# EasyEDA Pro project ProPrj_CH374_AG32.epro

# Schematic CH374
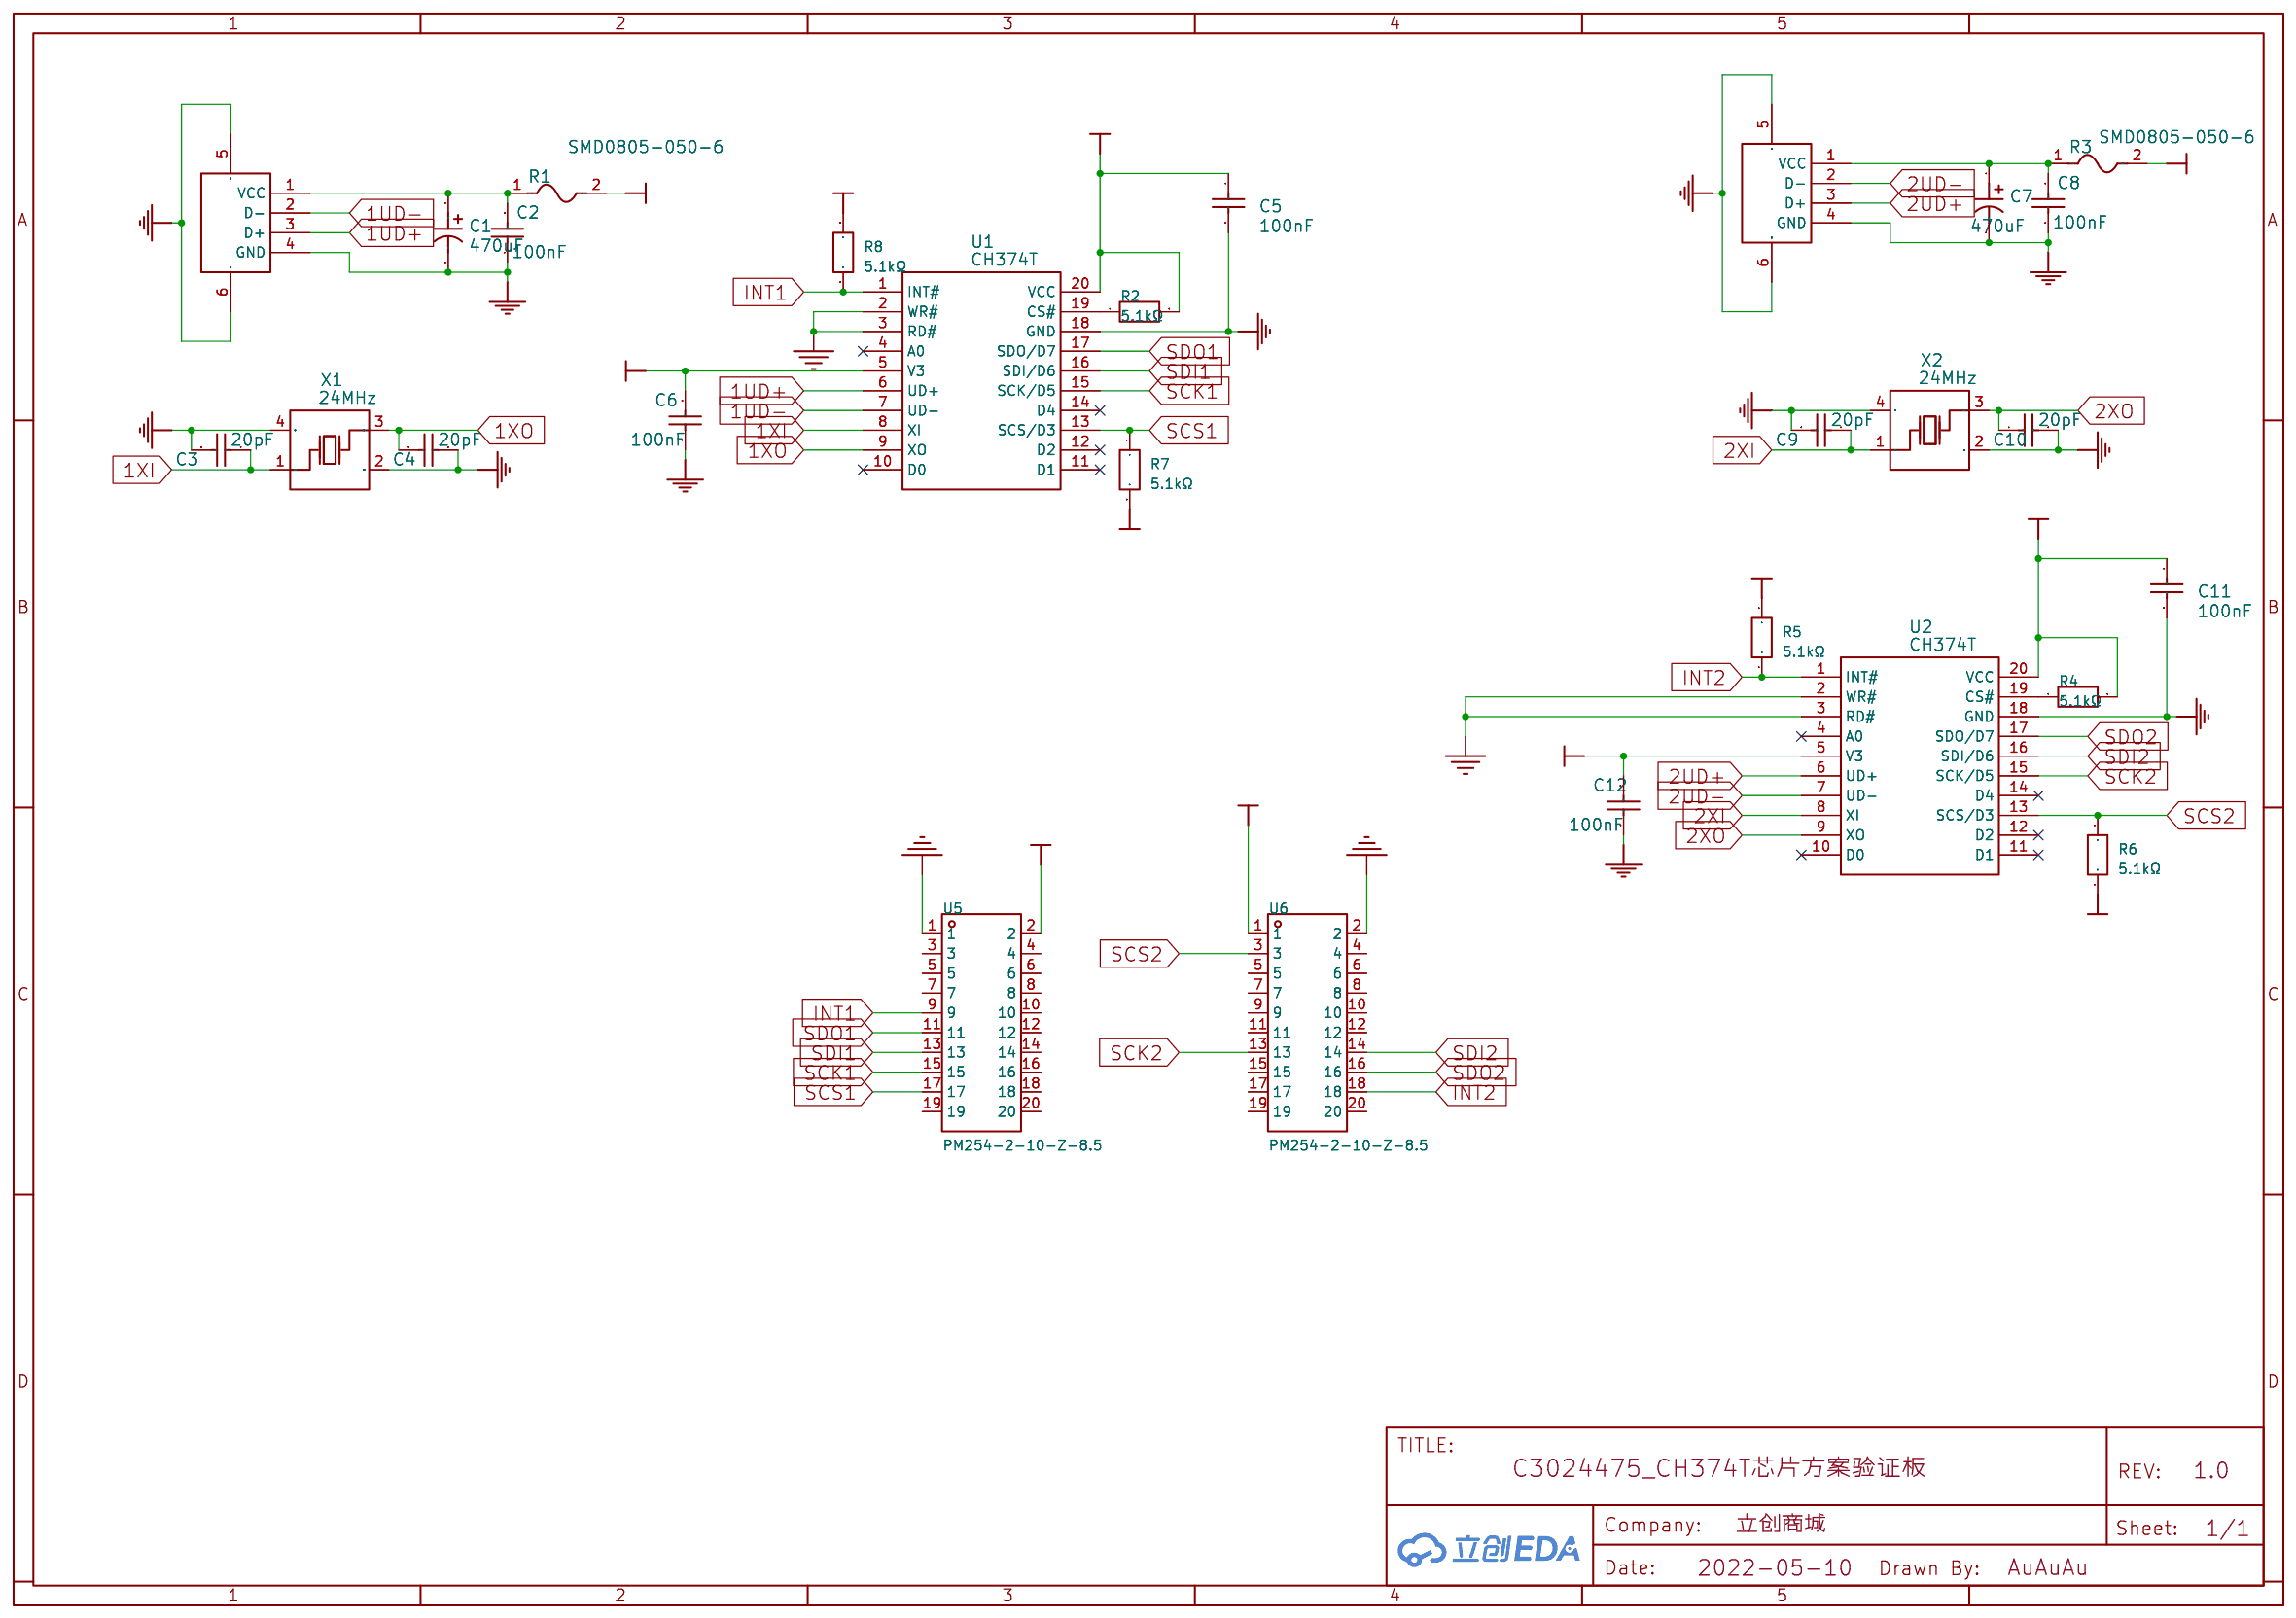
[diagram p0: schematic sheet]

## Parts
C1  470uF  [CAP-SMD_BD6.3-L6.6-W6.6-FD]
C2  100nF  [C0603]
C3  20pF  [C0603]
C4  20pF  [C0603]
C5  100nF  [C0603]
C6  100nF  [C0603]
C7  470uF  [CAP-SMD_BD6.3-L6.6-W6.6-FD]
C8  100nF  [C0603]
C9  20pF  [C0603]
C10  20pF  [C0603]
C11  100nF  [C0603]
C12  100nF  [C0603]
R1  SMD0805-050-6  [F0805]
R2  5.1kΩ  [R0603]
R3  SMD0805-050-6  [F0805]
R4  5.1kΩ  [R0603]
R5  5.1kΩ  [R0603]
R6  5.1kΩ  [R0603]
R7  5.1kΩ  [R0603]
R8  5.1kΩ  [R0603]
U1  CH374T  [SSOP-20_L7.5-W5.2-P0.65-LS8.0-BL]
U2  CH374T  [SSOP-20_L7.5-W5.2-P0.65-LS8.0-BL]
U5  PM254-2-10-Z-8.5  [HDR-TH_20P-P2.54-V-F-R2-C10-S2.54]
U6  PM254-2-10-Z-8.5  [HDR-TH_20P-P2.54-V-F-R2-C10-S2.54]
USB1  U-USBAR04P-F002  [USB-A-TH_USB-302-T]
USB2  U-USBAR04P-F002  [USB-A-TH_USB-302-T]
X1  24MHz  [CRYSTAL-SMD_4P-L3.2-W2.5-BL]
X2  24MHz  [CRYSTAL-SMD_4P-L3.2-W2.5-BL]

## Library data of the parts
C1 C7 = RVT1A471M0607_C335982: 容值:470uF;精度:±20%;额定电压:10V;纹波电流:200mA@120Hz;等效串联电阻(ESR):-;; LCSC Part Name: 470uF ±20% 10V; Supplier Part: C335982; Manufacturer: ROQANG(容强); Manufacturer Part: RVT1A471M0607; Supplier Footprint: SMD,D6.3xL7.7mm; JLCPCB Part Class: Extended Part; Supplier: LCSC; Tolerance: ±20%; Voltage Rating: 10V; Ripple Current: 200mA@120Hz; Diameter: 6.3mm; Height - Seated (Max): 7.7mm; Lifetime: 2000hrs@105℃; Operating Temperature: -40℃~+105℃; PCB Layer: TopLayer
C2 C5 C6 = 0603B104K500NT: 容值:100nF;精度:±10%;额定电压:50V;温度系数:X7R;; LCSC Part Name: 100nF ±10% 50V; Supplier Part: C30926; Manufacturer: FH(风华); Supplier Footprint: 0603; JLCPCB Part Class: Extended Part; Datasheet: https://item.szlcsc.com/datasheet/0603B104K500NT/31683.html; Supplier: LCSC; Tolerance: ±10%; Voltage Rating: 50V; Temperature Coefficient: X7R; PCB Layer: TopLayer
C3 C4 = CC0603JRNPO9BN200: 容值:20pF;精度:±5%;额定电压:50V;材质(温度系数):NP0;; LCSC Part Name: 20pF ±5% 50V; Supplier Part: C105621; Manufacturer: YAGEO(国巨); Supplier Footprint: 0603; JLCPCB Part Class: Extended Part; Datasheet: https://atta.szlcsc.com/upload/public/pdf/source/20170505/1493957838062.pdf; Supplier: LCSC; Tolerance: ±5%; Voltage Rated: 50V; Temperature Coefficient: NP0; PCB Layer: TopLayer
C8 C11 C12 = 0603B104K500NT: 容值:100nF;精度:±10%;额定电压:50V;温度系数:X7R;; LCSC Part Name: 100nF ±10% 50V; Supplier Part: C30926; Manufacturer: FH(风华); Supplier Footprint: 0603; JLCPCB Part Class: Extended Part; Datasheet: https://item.szlcsc.com/datasheet/0603B104K500NT/31683.html; Supplier: LCSC; Tolerance: ±10%; Voltage Rating: 50V; Temperature Coefficient: X7R; Origin 3D Model Title: C0603_L1.6-W0.8-H0.8; PCB Layer: TopLayer
C9 C10 = CC0603JRNPO9BN200: 容值:20pF;精度:±5%;额定电压:50V;材质(温度系数):NP0;; LCSC Part Name: 20pF ±5% 50V; Supplier Part: C105621; Manufacturer: YAGEO(国巨); Supplier Footprint: 0603; JLCPCB Part Class: Extended Part; Datasheet: https://atta.szlcsc.com/upload/public/pdf/source/20170505/1493957838062.pdf; Supplier: LCSC; Tolerance: ±5%; Voltage Rated: 50V; Temperature Coefficient: NP0; Origin 3D Model Title: C0603_L1.6-W0.8-H0.8; PCB Layer: TopLayer
R1 R3 = SMD0805-050-6: 耐压(Vmax):6V;最大电流(Imax):40A;保持电流(Ihold):500mA;跳闸电流(Itrip):1A;; LCSC Part Name: 6V 500mA; Supplier Part: C46640983; Manufacturer: R+O(宏嘉诚); Supplier Footprint: 0805; JLCPCB Part Class: Extended Part; Datasheet: https://item.szlcsc.com/datasheet/SMD0805-050-6/48798689.html; Supplier: LCSC; Voltage - Max: 6V; Current - Max: 40A; Hold Current: 500mA; Trip Current: 1A; Power Dissipation: 500mW; Resistance - Initial (Ri) (Min): 100mΩ; Resistance - Post Trip (R1) (Max): 850mΩ; Time to Trip(Max): 100ms; Operating Temperature: -40℃~+85℃; Length: 2.2mm; Width: 1.5mm; Height: 0.8mm
R2 R4-R8 = FRC0603F5101TS: 电阻类型:厚膜电阻;阻值:5.1kΩ;精度:±1%;功率:100mW;工作电压:75V;温度系数:±100ppm/℃;; LCSC Part Name: 5.1kΩ ±1% 100mW 厚膜电阻; Supplier Part: C2907044; Manufacturer: FOJAN(富捷); Supplier Footprint: 0603; JLCPCB Part Class: Extended Part; Supplier: LCSC; Type: 厚膜电阻; Tolerance: ±1%; Power(Watts): 100mW; Voltage-Supply(Max): 75V; Temperature Coefficient: ±100ppm/℃; Operating Temperature: -55℃~+155℃
U1 = CH374T: 应用功能:收发器;接口协议:USB 2.0;通道数:3;数据速率:12Mbps;; LCSC Part Name: USB总线接口芯片CH374; Supplier Part: C81627; Manufacturer: WCH(南京沁恒); Supplier Footprint: SSOP-20-208mil; JLCPCB Part Class: Extended Part; Datasheet: https://atta.szlcsc.com/upload/public/pdf/source/20240313/68BEEFB9FCA26BF3F560373D7752B1DD.pdf; Supplier: LCSC; Applications Function: 收发器; Protocol: USB 2.0; Number of Channels: 3; Supply Voltage: 5V；3.3V; Data Rate: 12Mbps; Operating Temperature: -40℃~+85℃; PCB Layer: TopLayer
U2 = CH374T: 应用功能:收发器;接口协议:USB 2.0;通道数:3;数据速率:12Mbps;; LCSC Part Name: USB总线接口芯片CH374; Supplier Part: C81627; Manufacturer: WCH(南京沁恒); Supplier Footprint: SSOP-20-208mil; JLCPCB Part Class: Extended Part; Datasheet: https://atta.szlcsc.com/upload/public/pdf/source/20240313/68BEEFB9FCA26BF3F560373D7752B1DD.pdf; Supplier: LCSC; Applications Function: 收发器; Protocol: USB 2.0; Number of Channels: 3; Supply Voltage: 5V；3.3V; Data Rate: 12Mbps; Operating Temperature: -40℃~+85℃; Origin 3D Model Title: SSOP-20_L7.3-W5.3-H2.0-LS8.0-P0.65; PCB Layer: TopLayer
U5 U6 = PM254-2-10-Z-8.5: 插孔结构:2x10P;间距:2.54mm;行距:2.54mm;圆孔/方孔:方孔;安装方式:直插;排数:双排;总孔位数:20P;额定电流:3A;额定电压:-;插孔方向:顶部;塑高:8.5mm;触头材质:铜合金;工作温度:-40℃~+105℃;; LCSC Part Name: 2x10P 间距:2.54mm 直插; Supplier Part: C2897411; Manufacturer: HCTL(华灿天禄); Supplier Footprint: 插件,P=2.54mm; JLCPCB Part Class: Extended Part; Datasheet: https://item.szlcsc.com/datasheet/PM254-2-10-Z-8.5/3142416.html; Supplier: LCSC; Holes Structure: 2x10P; Pitch: 2.54mm; Row Spacing: 2.54mm; Circular Hole / Square Hole: 方孔; Mounting Type: 直插; Number of Rows: 双排; Number of Positions: 20P; Current Rating: 3A; Holes Direction: 顶部; Insulation Height: 8.5mm; Contact Material: 铜合金; Operating Temperature: -40℃~+105℃
USB1 USB2 = U-USBAR04P-F002: 连接器类型:Type-A;协议标准:USB 2.0;公母:母;安装方式:弯插;触点数量:4P;端口数量:1;额定电流 - 电源:1.5A;工作温度:0℃~+50℃;; LCSC Part Name: USB母座; Supplier Part: C386736; Manufacturer: Ckmtw(灿科盟); Supplier Footprint: 弯插; JLCPCB Part Class: Extended Part; Datasheet: https://item.szlcsc.com/datasheet/U-USBAR04P-F002/360843.html; Supplier: LCSC; Connector Type: Type-A; Protocol Standard: USB 2.0; Gender: 母; Mounting Type: 弯插; Number of Contacts: 4P; Number of Ports: 1; Current Rating-Power: 1.5A; Voltage Rating: 30V; Length: 14mm; Detection color: 白色; Operating Temperature: 0℃~+50℃; Connect-Disconnect Life: 5千次; PCB Layer: TopLayer
X1 = X322524MSB4SI: 晶振类型:贴片晶振;频率:24MHz;常温频差:±10ppm;负载电容:20pF;频率稳定度:±20ppm;; LCSC Part Name: YSX321SL 24MHZ 4P 3225 20PF ±10PPM -40~85℃ (±20PPM); Supplier Part: C15643; Manufacturer: YXC(扬兴晶振); Supplier Footprint: SMD3225-4P; JLCPCB Part Class: Extended Part; Datasheet: https://item.szlcsc.com/datasheet/X322524MSB4SI/16324.html; Supplier: LCSC; Type: 贴片晶振; Normal temperature Frequency Tolerance: ±10ppm; Load Capacitance: 20pF; Frequency Stability: ±20ppm; Operating Temperature: -40℃~+85℃; PCB Layer: TopLayer
X2 = X322524MSB4SI: 晶振类型:贴片晶振;频率:24MHz;常温频差:±10ppm;负载电容:20pF;频率稳定度:±20ppm;; LCSC Part Name: YSX321SL 24MHZ 4P 3225 20PF ±10PPM -40~85℃ (±20PPM); Supplier Part: C15643; Manufacturer: YXC(扬兴晶振); Supplier Footprint: SMD3225-4P; JLCPCB Part Class: Extended Part; Datasheet: https://item.szlcsc.com/datasheet/X322524MSB4SI/16324.html; Supplier: LCSC; Type: 贴片晶振; Normal temperature Frequency Tolerance: ±10ppm; Load Capacitance: 20pF; Frequency Stability: ±20ppm; Operating Temperature: -40℃~+85℃; Origin 3D Model Title: OSC-SMD_4P-L3.2-W2.5-H1.0; PCB Layer: TopLayer

## Nets
3V3: C5.1 C6.2 C11.1 C12.2 R2.2 R4.2 R5.2 R6.2 R7.2 R8.2 U1.5(V3) U1.20(VCC) U2.5(V3) U2.20(VCC) U5.2
5V: R1.2 R3.2 U6.1
GND: C1.2 C2.1 C3.2 C4.2 C5.2 C6.1 C7.2 C8.1 C9.2 C10.2 C11.2 C12.1 U1.2(WR#) U1.3(RD#) U1.18(GND) U2.2(WR#) U2.3(RD#) U2.18(GND) U5.1 U6.2 USB1.4(GND) USB1.5(SH1) USB1.6(SH2) USB2.4(GND) USB2.5(SH1) USB2.6(SH2) X1.2(GND) X1.4(GND) X2.2(GND) X2.4(GND)
1UD+: U1.6(UD+) USB1.3(D+)
1UD-: U1.7(UD-) USB1.2(D-)
1XI: C3.1 U1.8(XI) X1.1(OSC1)
1XO: C4.1 U1.9(XO) X1.3(OSC2)
2UD+: U2.6(UD+) USB2.3(D+)
2UD-: U2.7(UD-) USB2.2(D-)
2XI: C9.1 U2.8(XI) X2.1(OSC1)
2XO: C10.1 U2.9(XO) X2.3(OSC2)
INT1: R8.1 U1.1(INT#) U5.9
INT2: R5.1 U2.1(INT#) U6.18
SCK1: U1.15(SCK/D5) U5.15
SCK2: U2.15(SCK/D5) U6.13
SCS1: R7.1 U1.13(SCS/D3) U5.17
SCS2: R6.1 U2.13(SCS/D3) U6.3
SDI1: U1.16(SDI/D6) U5.13
SDI2: U2.16(SDI/D6) U6.14
SDO1: U1.17(SDO/D7) U5.11
SDO2: U2.17(SDO/D7) U6.16
$2N64: R2.1 U1.19(CS#)
$2N79: R4.1 U2.19(CS#)
$2N209: C1.1 C2.2 R1.1 USB1.1(VCC)
$2N212: C7.1 C8.2 R3.1 USB2.1(VCC)

Not connected (* = marked no-connect by the designer): U1 4(A0)* 10(D0)* 11(D1)* 12(D2)* 14(D4)*; U2 4(A0)* 10(D0)* 11(D1)* 12(D2)* 14(D4)*; U5 3 4 5 6 7 8 10 12 14 16 18 19 20; U6 4 5 6 7 8 9 10 11 12 15 17 19 20

# Board PCB1
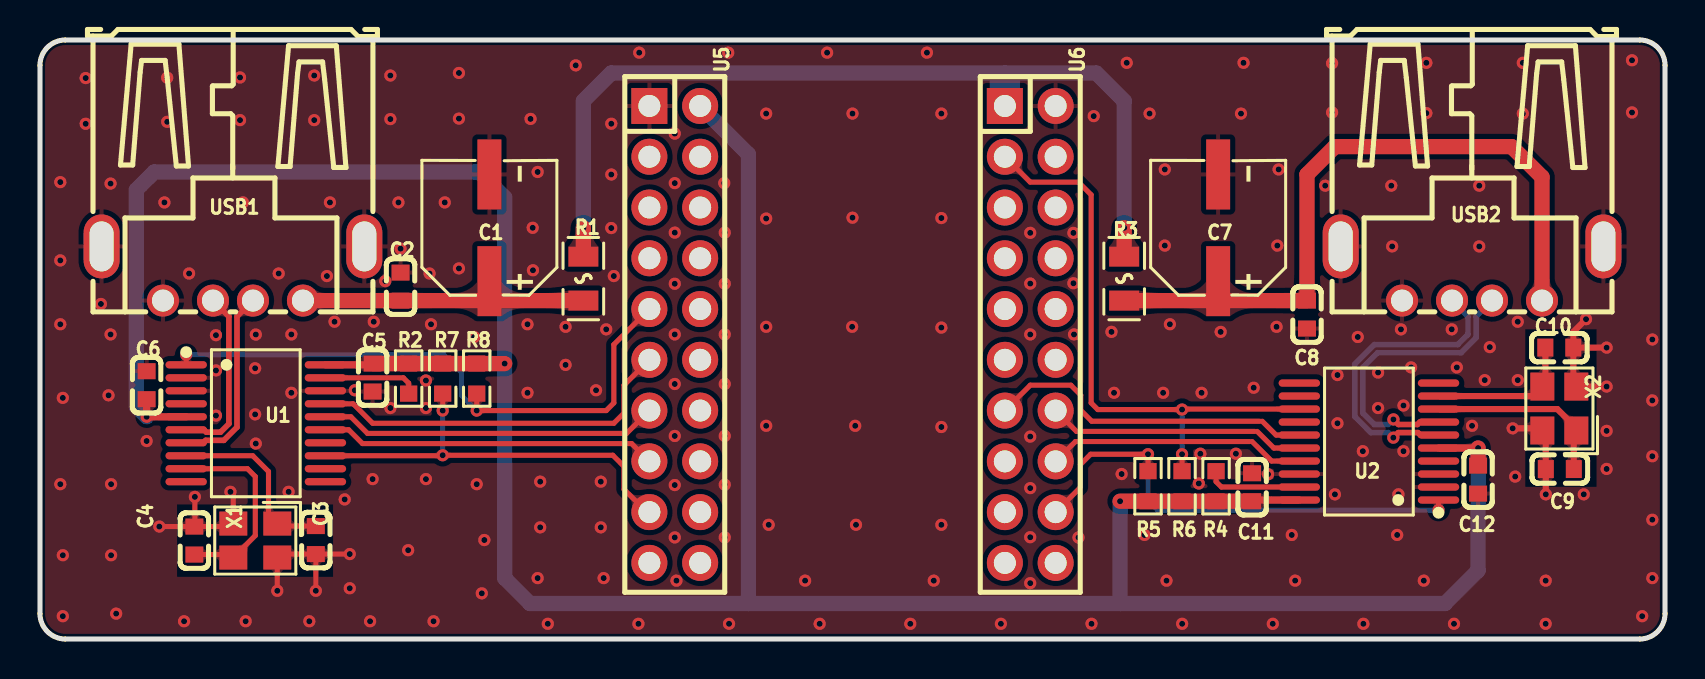
[diagram p1: board, top side]
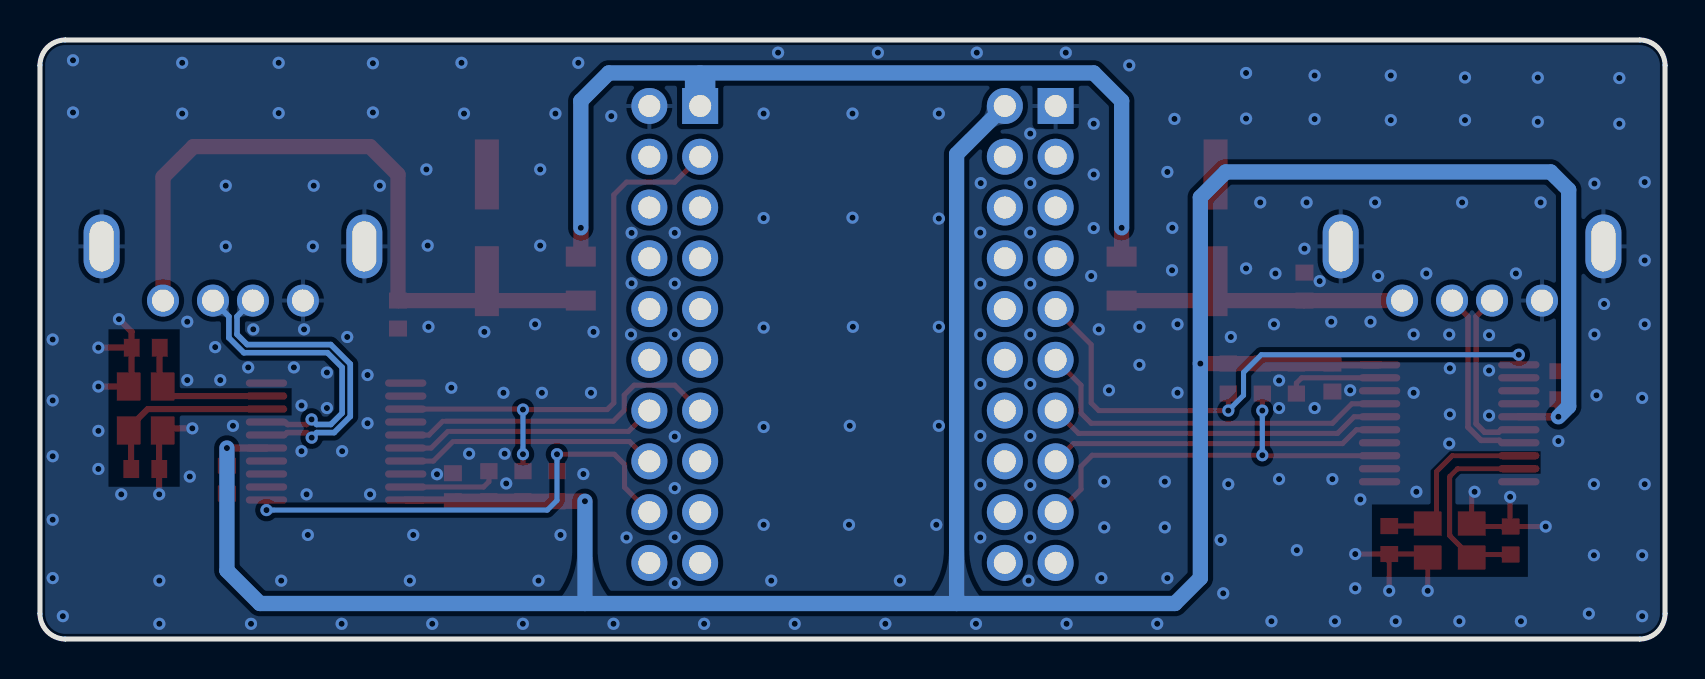
[diagram p2: board, bottom side, seen from below]

Outline 81.28 x 29.97 mm; copper layers: Top Layer, Bottom Layer. Coordinates in mm from the lower left corner of the outline.
Outline path: 0,28.7 0,1.27 arc(0.37,0.37) 1.27,0 80.01,0 arc(80.91,0.37) 81.28,1.27 81.28,28.7 arc(80.91,29.6) 80.01,29.97 1.27,29.97 arc(0.37,29.6) 0,28.7
Stack: Top Layer 0.035mm / Dielectric1 1.51mm FR4 er 4.5 / Bottom Layer 0.035mm

## Design rules (mm)
net 1UD+: 1UD
net 1UD-: 1UD
net 2UD+: usb2
net 2UD-: usb2
spacing copperThickness1oz (default): track to track 0.102, other pairs 0.152 to 0.3
spacing copperThickness2oz: track to track 0.203, other pairs 0.152 to 0.3
track width copperThickness1oz (default): min 0.127, default 0.254, max 2.54
track width copperThickness2oz: min 0.203, default 0.254, max 2.54
differential pair differentialPair (default): width min 0.127, default 0.279, max 2.54; gap min 0.127, default 0.127

## Placement (name value [footprint] x y rotation side)
C1  470uF  [CAP-SMD_BD6.3-L6.6-W6.6-FD]  22.48 20.57 90 top
C2  100nF  [C0603]  18.03 17.63 270 top
C3  20pF  [C0603]  13.8 4.95 270 top
C4  20pF  [C0603]  7.72 4.93 90 top
C5  100nF  [C0603]  16.64 13.08 270 top
C6  100nF  [C0603]  5.33 12.7 270 top
C7  470uF  [CAP-SMD_BD6.3-L6.6-W6.6-FD]  58.93 20.57 90 top
C8  100nF  [C0603]  63.37 16.23 90 top
C9  20pF  [C0603]  76.02 8.5 180 top
C10  20pF  [C0603]  75.99 14.58 0 top
C11  100nF  [C0603]  60.63 7.59 90 top
C12  100nF  [C0603]  71.93 7.98 90 top
R1  SMD0805-050-6  [F0805]  27.18 18.03 90 top
R2  5.1kΩ  [R0603]  18.44 13.03 90 top
R3  SMD0805-050-6  [F0805]  54.23 18.03 90 top
R4  5.1kΩ  [R0603]  58.83 7.64 270 top
R5  5.1kΩ  [R0603]  55.42 7.64 270 top
R6  5.1kΩ  [R0603]  57.12 7.64 270 top
R7  5.1kΩ  [R0603]  20.14 13.03 90 top
R8  5.1kΩ  [R0603]  21.84 13.03 90 top
U1  CH374T  [SSOP-20_L7.5-W5.2-P0.65-LS8.0-BL]  10.8 10.79 270 top
U2  CH374T  [SSOP-20_L7.5-W5.2-P0.65-LS8.0-BL]  66.47 9.88 90 top
U5  PM254-2-10-Z-8.5  [HDR-TH_20P-P2.54-V-F-R2-C10-S2.54]  31.75 15.24 270 top
U6  PM254-2-10-Z-8.5  [HDR-TH_20P-P2.54-V-F-R2-C10-S2.54]  49.53 15.24 270 top
USB1  U-USBAR04P-F002  [USB-A-TH_USB-302-T]  9.65 18.29 180 top
USB2  U-USBAR04P-F002  [USB-A-TH_USB-302-T]  71.63 18.29 180 top
X1  24MHz  [CRYSTAL-SMD_4P-L3.2-W2.5-BL]  10.77 4.93 180 top
X2  24MHz  [CRYSTAL-SMD_4P-L3.2-W2.5-BL]  75.99 11.53 90 top

## Footprints (pads in the part's own frame, mm; a bottom-side part is the same pattern mirrored in y, then rotated)
C0603
  rect 0.8x0.9 smd: 1(-0.7,0) 2(0.7,0)
CAP-SMD_BD6.3-L6.6-W6.6-FD
  rect 3.5x1.2 smd: 1(-2.67,0) 2(2.67,0)
CRYSTAL-SMD_4P-L3.2-W2.5-BL
  rect 1.4x1.2 smd: 1(-1.1,-0.85) 2(1.1,-0.85) 3(1.1,0.85) 4(-1.1,0.85)
F0805
  rect 1x1.5 smd: 1(-1.1,0) 2(1.1,0)
HDR-TH_20P-P2.54-V-F-R2-C10-S2.54
  rect 1.8x1.8 hole 1.1: 1(-11.43,-1.27)
  round 1.8 hole 1.1: 2(-11.43,1.27) 3(-8.89,-1.27) 4(-8.89,1.27) 5(-6.35,-1.27) 6(-6.35,1.27) 7(-3.81,-1.27) 8(-3.81,1.27) 9(-1.27,-1.27) 10(-1.27,1.27) 11(1.27,-1.27) 12(1.27,1.27) 13(3.81,-1.27) 14(3.81,1.27) 15(6.35,-1.27) 16(6.35,1.27) 17(8.89,-1.27) 18(8.89,1.27) 19(11.43,-1.27) 20(11.43,1.27)
R0603
  rect 0.806x0.864 smd: 1(-0.753,0) 2(0.753,0)
SSOP-20_L7.5-W5.2-P0.65-LS8.0-BL
  oval 0.364x2.069 smd: 1(-2.925,-3.482) 2(-2.275,-3.482) 3(-1.625,-3.482) 4(-0.975,-3.482) 5(-0.325,-3.482) 6(0.325,-3.482) 7(0.975,-3.482) 8(1.625,-3.482) 9(2.275,-3.482) 10(2.925,-3.482) 11(2.925,3.482) 12(2.275,3.482) 13(1.625,3.482) 14(0.975,3.482) 15(0.325,3.482) 16(-0.325,3.482) 17(-0.975,3.482) 18(-1.625,3.482) 19(-2.275,3.482) 20(-2.925,3.482)
USB-A-TH_USB-302-T
  round 1.6 hole 1.1: 1(-3.5,1.355) 2(-1,1.355) 3(1,1.355) 4(3.5,1.355)
  oval 1.8x3.2 hole 1.2x2.5: 5(-6.57,-1.355) 6(6.57,-1.355)

## Nets
As in the schematic.

Pads without a net: U1 4 10 11 12 14; U2 4 10 11 12 14; U5 3 4 5 6 7 8 10 12 14 16 18 19 20; U6 4 5 6 7 8 9 10 11 12 15 17 19 20

## Via types
v1: diameter 0.61, hole 0.305, Top Layer to Bottom Layer, 251 vias

## Routing (per net, layer and track width the routed paths; a pad name or vN(x,y) marks a point on that pad's centre or on a via; arc(x,y) is an arc through that point)
3V3: length 160.5
  Top Layer w0.363: U1.5 v1(5.33,11.12) C6.2 ; U1.20 16.64,13.72 ; U2.5 v1(71.93,9.56) ; 62.99,6.95 60.63,6.95
  Top Layer w0.762: C5.1 v1(23.24,13.78) ; 60.5,6.89 v1(54.02,6.89) ; v1(71.93,9.56) C12.2
  Bottom Layer w0.762: v1(54.02,6.89) 54.02,1.78 ; 54.02,1.78 35.43,1.78 ; 54.02,1.78 70.28,1.78 71.93,3.43 v1(71.93,9.56) ; 35.43,1.78 24.51,1.78 23.24,3.05 v1(23.24,13.78) 23.24,22.1 21.97,23.37 5.72,23.37 4.82,22.47 4.82,11.63 v1(5.33,11.12) ; 35.43,1.78 35.43,24.26 U5.2
5V: length 45.1
  Top Layer w0.762: 54.23,19.13 v1(54.23,20.57) ; v1(27.18,20.57) 27.18,19.13
  Bottom Layer w0.762: v1(54.23,20.57) 54.23,26.92 52.83,28.32 28.58,28.32 27.18,26.92 v1(27.18,20.57)
  Bottom Layer w1.524: U6.1 48.26,27.94
GND: length 25.6
  Top Layer w0.254: C4.2 9.67,5.63 ; C4.2 7.75,5.65 v1(7.75,7.11) ; C4.2 v1(5.97,5.63) ; X1.2 9.67,7.22 v1(9.52,7.37) ; C3.2 v1(15.49,4.25) ; C3.2 v1(13.8,2.41) ; C3.2 11.87,4.25 ; X1.4 v1(11.87,2.41)
  Top Layer w0.305: C10.2 76.69,12.78 X2.2 v1(78.36,12.63) ; C10.2 76.69,15.37 v1(77.33,16) ; C10.2 v1(78.36,14.58) ; v1(75.32,7.24) C9.2 75.32,10.26 75.14,10.43 75.04,10.54 v1(73.66,10.54)
  vias: v1(1.02,22.86) v1(1.02,18.94) v1(1.02,15.75) v1(1.02,7.75) v1(1.14,12.06) v1(1.14,4.19) v1(1.14,1.14) v1(2.29,28.07) v1(2.29,25.78) v1(3.05,16.76) v1(3.43,12.19) v1(3.53,22.79) v1(3.53,15.24) v1(3.56,7.75) v1(3.56,4.19) v1(3.81,1.27) v1(5.33,9.91) v1(6.22,21.84) v1(6.36,28.09) v1(6.36,25.88) v1(7.21,0.89) v1(7.46,18.29) v1(8.8,15.2) v1(8.8,13.44) v1(8.8,11.18) v1(10,28.1) v1(10,25.96) v1(10.15,21.84) v1(10.29,0.89) v1(10.76,13.55) v1(10.76,11.24) v1(10.8,15.23) v1(10.8,9.78) v1(11.94,18.29) v1(12.44,7.37) v1(12.57,15.24) v1(12.57,12.32) v1(13.47,0.89) v1(13.72,28.19) v1(13.72,25.96) v1(14.35,18.16) v1(14.5,21.84) v1(14.73,15.88) v1(15.24,6.98) v1(15.49,2.54) v1(15.75,12.45) v1(16.51,0.89) v1(16.64,8) v1(16.69,15.88) v1(17.27,17.91) v1(17.53,28.19) v1(17.53,26.01) v1(17.53,11.56) v1(17.93,21.84) v1(18.03,19.53) v1(18.42,4.44) v1(19.3,12.93) v1(19.3,11.56) v1(19.3,8) v1(19.49,18.29) v1(19.56,15.75) v1(19.68,0.89) v1(20.25,21.84) v1(20.95,28.32) v1(20.95,26.04) v1(20.95,18.54) v1(21.72,15.11) v1(21.84,7.75) v1(22.1,2.29) v1(22.23,4.95) v1(24.38,15.75) v1(24.38,12.32) v1(24.54,26.02) v1(24.64,20.57) v1(24.66,18.45) v1(24.89,23.37) v1(24.89,3.05) v1(25.02,7.87) v1(25.02,5.59) v1(25.4,0.76) v1(26.29,15.62) v1(26.29,13.72) v1(26.8,28.7) v1(27.81,12.45) v1(28.05,7.87) v1(28.05,5.59) v1(28.19,3.05) v1(28.32,15.49) v1(28.58,25.78) v1(28.58,23.24) v1(28.58,20.56) v1(28.7,18.16) v1(29.97,29.34) v1(29.93,0.76) v1(31.75,25.29) v1(31.75,22.81) v1(31.75,20.33) v1(31.75,17.77) v1(31.75,15.24) v1(31.75,12.76) v1(31.75,10.16) v1(31.75,7.7) v1(31.75,5.08) v1(31.83,2.92) v1(34.23,22.81) v1(34.25,20.33) v1(34.25,17.77) v1(34.25,15.24) v1(34.25,12.76) v1(34.25,10.16) v1(34.25,7.72) v1(34.25,5.08) v1(34.42,29.34) v1(34.46,0.76) v1(36.32,26.29) v1(36.32,21.04) v1(36.32,15.62) v1(36.32,10.67) v1(36.45,5.71) v1(38.27,2.92) v1(39,0.76) v1(39.37,29.34) v1(40.64,26.29) v1(40.64,21.08) v1(40.62,15.62) v1(40.78,10.67) v1(40.81,5.71) v1(43.53,0.76) v1(44.36,29.34) v1(44.7,2.92) v1(45.08,26.29) v1(45.08,21.06) v1(45.08,15.58) v1(45.08,10.61) v1(45.08,5.71) v1(48.06,0.76) v1(49.53,20.32) v1(49.53,17.78) v1(49.53,15.24) v1(49.53,10.13) v1(49.53,7.55) v1(49.53,5.09) v1(49.53,2.79) v1(51.69,20.32) v1(51.69,17.8) v1(51.72,15.24) v1(51.94,5.08) v1(52.59,0.76) v1(52.7,26.16) v1(53.59,15.37) v1(53.72,12.32) v1(54.1,8.25) v1(54.36,28.83) v1(55.24,5.21) v1(55.5,26.29) v1(56.18,12.32) v1(56.26,23.49) v1(56.26,19.68) v1(56.35,2.92) v1(56.52,15.75) v1(57.13,0.76) v1(57.96,7.78) v1(58.04,9.27) v1(58.1,12.32) v1(59.05,15.37) v1(59.82,9.27) v1(60.07,26.29) v1(60.2,28.83) v1(60.71,12.57) v1(61.42,8.24) v1(61.66,0.76) v1(61.85,15.62) v1(61.95,23.49) v1(61.89,19.68) v1(62.61,5.21) v1(62.78,2.92) v1(64.28,22.68) v1(64.63,28.81) v1(64.63,26.34) v1(64.77,7.24) v1(64.9,13.21) v1(64.9,10.79) v1(65.91,15.11) v1(66.17,9.4) v1(66.19,0.76) v1(66.93,13.33) v1(66.93,11.56) v1(67.59,22.68) v1(67.63,19.64) v1(67.95,7.24) v1(67.88,5.21) v1(68.07,15.49) v1(68.2,11.68) v1(68.2,9.4) v1(68.58,13.59) v1(69.22,2.92) v1(69.34,28.83) v1(69.34,26.31) v1(70.61,15.49) v1(70.73,0.76) v1(70.87,13.59) v1(71.63,10.67) v1(71.99,22.68) v1(71.99,19.64) v1(72.26,12.95) v1(72.52,14.6) v1(73.79,8.13) v1(73.91,15.88) v1(73.91,12.95) v1(74.17,28.83) v1(74.17,26.29) v1(75.31,2.92) v1(75.31,0.76) v1(77.22,7.24) v1(78.36,10.41) v1(78.36,8.51) v1(79.63,28.96) v1(79.63,26.34) v1(80.14,1.14) v1(80.64,14.99) v1(80.64,11.94) v1(80.64,9.14) v1(80.64,5.97) v1(80.64,3.05)
1UD+: length 8.9
  Top Layer w0.28: U1.6 8.2,10.47 8.32,10.35 9.03,10.35 9.45,10.77 9.45,16.14 USB1.3
1UD-: length 9.5
  Top Layer w0.28: USB1.2 9.86,16.14 9.86,10.6 9.2,9.94 8.29,9.94 8.17,9.82 U1.7
1XI: length 8.5
  Top Layer w0.254: U1.8 10.64,9.17 11.43,8.38 11.43,6.22 ; C3.1 11.87,5.65
1XO: length 10.1
  Top Layer w0.254: C4.1 9.67,4.23 ; U1.9 10.38,8.52 10.77,8.13 10.77,5.18 X1.3
2UD+: length 15.6
  Top Layer w0.28: v1(67.69,10.08) 67.94,10.33 68.92,10.33 69.04,10.21 69.83,10.21
  Bottom Layer w0.28: v1(67.69,10.08) 67.44,10.33 66.57,10.33 65.76,11.13 65.76,13.76 66.74,14.73 70.92,14.73 71.42,15.24 71.42,16.14 USB2.3
2UD-: length 14.9
  Top Layer w0.28: 69.83,10.86 69.02,10.86 68.9,10.73 67.95,10.73 v1(67.7,10.99)
  Bottom Layer w0.28: USB2.2 71.83,16.14 71.83,15.07 71.08,14.33 66.9,14.33 66.17,13.59 66.17,11.3 66.74,10.73 67.44,10.73 v1(67.7,10.99)
2XI: length 9.1
  Top Layer w0.305: C9.1 76.72,10.3 ; 76.84,10.55 75.89,11.51 U2.8
2XO: length 7.2
  Top Layer w0.305: X2.3 75.29,12.78 C10.1 ; 75.14,12.16 U2.9
INT1: length 30.2
  Top Layer w0.254: U1.1 v1(7.31,14.22) ; R8.1 v1(21.84,11.43) 28.32,11.43 28.7,11.81 28.7,14.73 U5.9
  Bottom Layer w0.254: v1(21.84,11.43) 21.08,12.19 21.08,13.33 20.19,14.22 v1(7.31,14.22)
INT2: length 24.9
  Top Layer w0.254: U6.18 52.04,7.59 52.04,8.73 52.55,9.25 v1(55.42,9.25) R5.1 ; 69.95,6.95 v1(69.95,6.45)
  Bottom Layer w0.254: v1(69.95,6.45) 55.91,6.45 55.42,6.94 v1(55.42,9.25)
SCK1: length 16.9
  Top Layer w0.254: U5.15 29.59,9.78 16.13,9.78 15.44,10.47 U1.15
SCK2: length 16.6
  Top Layer w0.254: 61.01,10.9 52.6,10.9 52.06,11.44 52.06,12.2 51.56,12.7 49.53,12.7 U6.13 ; 61.14,10.9 61.83,10.21 U2.15
SCS1: length 21.1
  Top Layer w0.254: U5.17 30.35,6.35 29.21,7.49 29.21,8.64 28.65,9.19 v1(20.14,9.19) ; U1.13 20.07,9.17 ; R7.1 v1(20.14,11.43)
  Bottom Layer w0.254: v1(20.14,11.43) v1(20.14,9.19)
SCS2: length 29.1
  Top Layer w0.254: U2.13 57.2,11.51 ; U6.3 49.53,22.86 51.94,22.86 52.58,22.22 52.58,11.81 52.91,11.48 v1(57.12,11.48) ; R6.1 v1(57.12,9.25)
  Bottom Layer w0.254: v1(57.12,9.25) v1(57.12,11.48)
SDI1: length 17
  Top Layer w0.254: U5.13 29.34,10.29 16.38,10.29 15.55,11.12 U1.16
SDI2: length 12.8
  Top Layer w0.254: U2.16 61.71,9.56 60.88,10.39 ; 60.75,10.39 51.84,10.39 U6.14
SDO1: length 18.7
  Top Layer w0.254: U1.17 15.66,11.77 16.64,10.79 28.7,10.79 29.21,11.3 29.21,12.7 U5.11
SDO2: length 12.9
  Top Layer w0.254: U6.16 51.79,9.88 60.5,9.88 ; U2.17 61.6,8.9 60.63,9.88
$2N64: length 4.8
  Top Layer w0.254: U1.19 18.17,13.07 18.44,12.8 R2.1
$2N79: length 4.8
  Top Layer w0.254: U2.19 59.09,7.6 58.83,7.87 R4.1
$2N209: length 14
  Top Layer w0.762: USB1.1 C2.2 R1.1
$2N212: length 34.6
  Top Layer w0.762: R3.1 C8.2 63.37,23.24 64.77,24.64 73.6,24.64 75.13,23.11 USB2.1

## Copper pours and planes (outline as drawn; the poured copper is in the pictures)
GND on Top Layer: -1.4,31.24 87.38,31.24 87.38,-2.29 -1.4,-2.29
GND on Bottom Layer: -2.54,32.51 85.98,32.51 85.98,-2.03 -2.54,-2.03

Small or netless copper shapes (teardrops, artwork), in the pictures only: 130 on Top Layer, 15 on Bottom Layer
